# Altium schematic sheet Connectors.SchDoc
size A4; DocumentNumber: 6; SheetNumber: 6; SheetTotal: 6
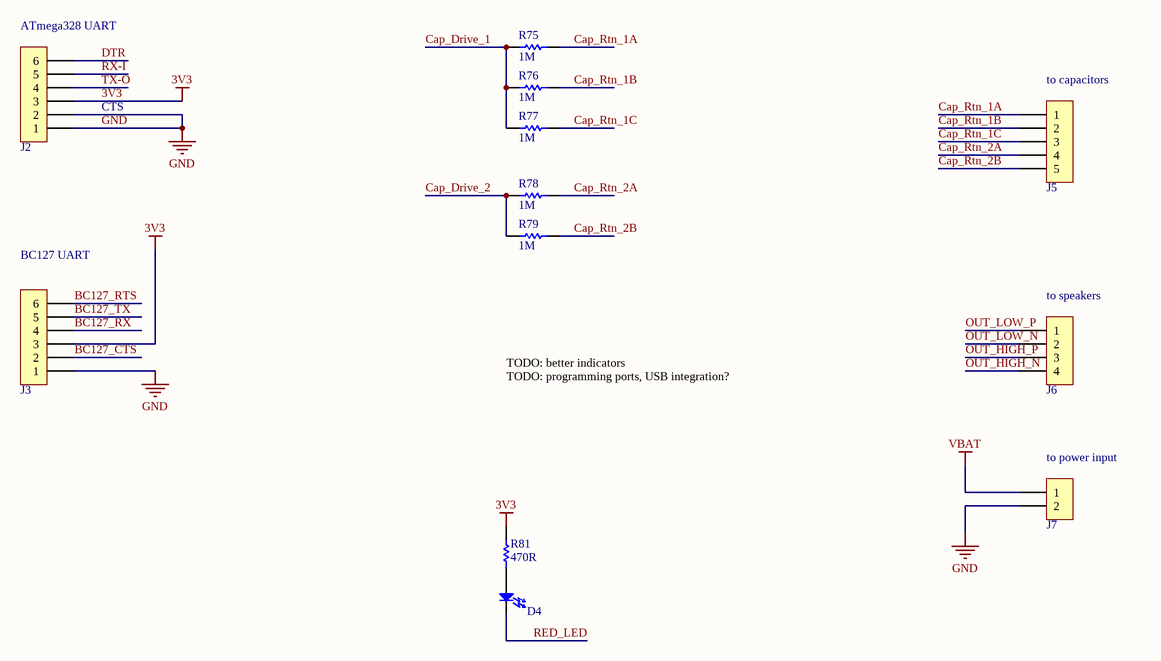
[diagram p0: Connectors.SchDoc]

## Parts
D4  LED 0603  [DIOM1608X08N]  (value not drawn)
J2  6POS THRU HOLE 2.54MM  [90147-1106]  (value not drawn)
J3  6POS THRU HOLE 2.54MM  [90147-1106]  (value not drawn)
J5  5POS THRU HOLE 2.54MM  [70543-0004]  (value not drawn)
J6  TERMINAL BLOCK 4POS  [TERMINAL BLOCK 5MM 4POS]  (value not drawn)
J7  TERMINAL BLOCK 2POS  [TERMINAL BLOCK 5MM 2POS]  (value not drawn)
R75  1M  [RESC1608X06N]
R76  1M  [RESC1608X06N]
R77  1M  [RESC1608X06N]
R78  1M  [RESC1608X06N]
R79  1M  [RESC1608X06N]
R81  470R  [RESC1608X06N]

## Nets
3V3: J2.3 J3.3 R81.2
GND: J2.1 J2.2 J3.1 J7.2
VBAT: J7.1
BC127_CTS: J3.2
BC127_RTS: J3.6
BC127_RX: J3.4
BC127_TX: J3.5
Cap_Drive_1: R75.1 R76.1 R77.1
Cap_Drive_2: R78.1 R79.1
Cap_Rtn_1A: J5.1 R75.2
Cap_Rtn_1B: J5.2 R76.2
Cap_Rtn_1C: J5.3 R77.2
Cap_Rtn_2A: J5.4 R78.2
Cap_Rtn_2B: J5.5 R79.2
DTR: J2.6
OUT_HIGH_N: J6.4
OUT_HIGH_P: J6.3
OUT_LOW_N: J6.2
OUT_LOW_P: J6.1
RED_LED: D4.1(K2)
RX-I: J2.5
TX-O: J2.4
NetD4_2: D4.2(A2) R81.1

## Notes on the sheet
- (near J2) ATmega328 UART
- CTS
- (near J5) to capacitors
- (near J3) BC127 UART
- (near J6) to speakers
- TODO: better indicators
- TODO: programming ports, USB integration?
- (near J7) to power input

## Library data of the parts
D4 = LED 0603: Voltage: 2.2V; Configuration: Single; Current: 20mA; Footprint: 0603; Temperature: 85dC; Digikey Part Number: 160-1447-1-ND
R75-R79 = RES 1M 0603: Tolerance: 1%; Power: 0.1W; Footprint: 0603; Value: 1M; Digikey Part Number: 311-1.00MHRCT-ND
R81 = RES 470R 0603: Tolerance: 1%; Power: 0.25W; Type: RES; Footprint: 0603; Value: 470R; Digikey Part Number: 311-470HRCT-ND
J6 = TERMINAL BLOCK 4POS: Digikey Part Number: ED2563-ND
J7 = TERMINAL BLOCK 2POS: Digikey Part Number: ED2561-ND